# Altium schematic sheet toplayer UCM updated.SchDoc
size A4; SheetNumber: 1; SheetTotal: 5
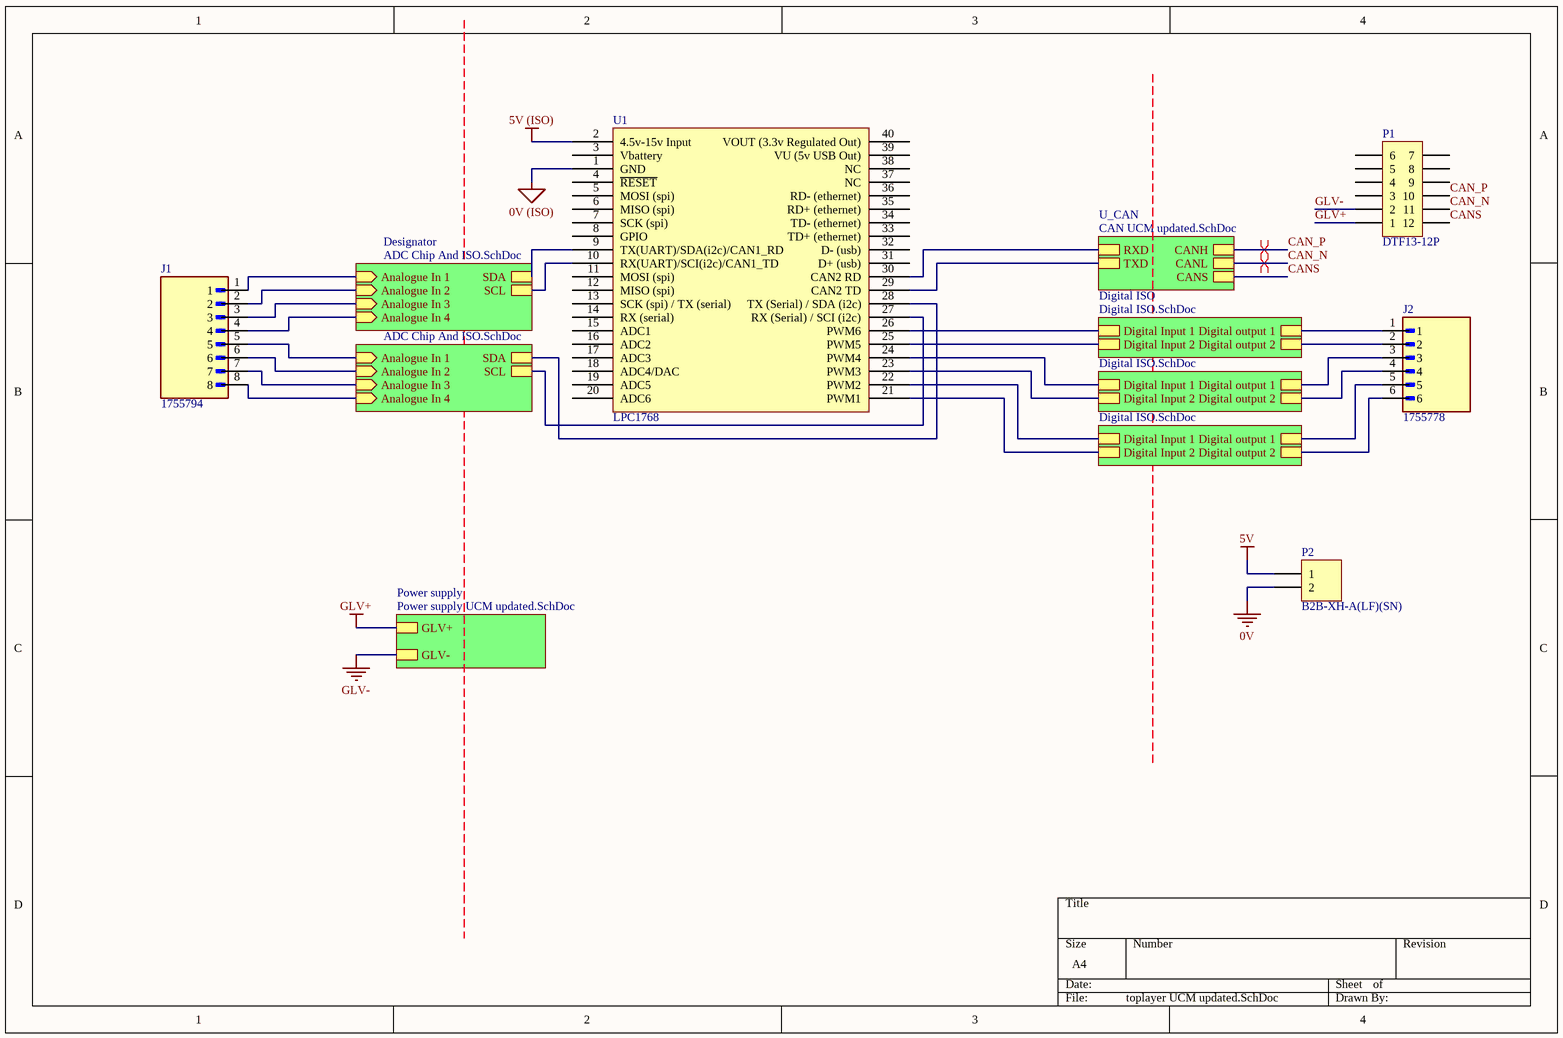
[diagram p0: toplayer UCM updated.SchDoc]

## Parts
J1  1755794  [PHOENIX_1755794]
J2  1755778  [PHOENIX_1755778]
P1  DTF13-12P  [DTF13-12P]
P2  B2B-XH-A(LF)(SN)  [XH 2 PIN VERT]
U1  LPC1768  [LPC1768]

## Sub-sheets
Designator = Digital ISO.SchDoc: Digital Input 1, Digital Input 2, Digital output 1, Digital output 2
Designator = ADC Chip And ISO.SchDoc: Analogue In 1 (in), Analogue In 2 (in), SDA, SCL, Analogue In 3 (in), Analogue In 4 (in)
Designator = ADC Chip And ISO.SchDoc: Analogue In 1 (in), Analogue In 2 (in), SDA, SCL, Analogue In 3 (in), Analogue In 4 (in)
Digital ISO = Digital ISO.SchDoc: Digital Input 1, Digital Input 2, Digital output 1, Digital output 2
Digital ISO = Digital ISO.SchDoc: Digital Input 1, Digital Input 2, Digital output 1, Digital output 2
Power supply = Power supply UCM updated.SchDoc: GLV+, GLV-
U_CAN = CAN UCM updated.SchDoc: RXD, TXD, CANH, CANL, CANS

## Nets
0V: P2.2
0V (ISO): U1.1(GND)
5V: P2.1
5V (ISO): U1.2(4.5v-15v_Input)
GLV+: P1.1 ; sheet Power supply/GLV+
GLV-: P1.2 ; sheet Power supply/GLV-
CAN_N: P1.11 ; sheet U_CAN/CANL
CAN_P: P1.10 ; sheet U_CAN/CANH
CANS: P1.12 ; sheet U_CAN/CANS
NetJ1_1: J1.1 ; sheet Designator/Analogue In 1
NetJ1_2: J1.2 ; sheet Designator/Analogue In 2
NetJ1_3: J1.3 ; sheet Designator/Analogue In 3
NetJ1_4: J1.4 ; sheet Designator/Analogue In 4
NetJ1_5: J1.5 ; sheet Designator/Analogue In 1
NetJ1_6: J1.6 ; sheet Designator/Analogue In 2
NetJ1_7: J1.7 ; sheet Designator/Analogue In 3
NetJ1_8: J1.8 ; sheet Designator/Analogue In 4
NetJ2_1: J2.1 ; sheet Digital ISO/Digital output 1
NetJ2_2: J2.2 ; sheet Digital ISO/Digital output 2
NetJ2_3: J2.3 ; sheet Digital ISO/Digital output 1
NetJ2_4: J2.4 ; sheet Digital ISO/Digital output 2
NetJ2_5: J2.5 ; sheet Designator/Digital output 1
NetJ2_6: J2.6 ; sheet Designator/Digital output 2
NetU1_9: U1.9(TX(UART)/SDA(i2c)/CAN1_RD) ; sheet Designator/SDA
NetU1_10: U1.10(RX(UART)/SCI(i2c)/CAN1_TD) ; sheet Designator/SCL
NetU1_21: U1.21(PWM1) ; sheet Designator/Digital Input 2
NetU1_22: U1.22(PWM2) ; sheet Designator/Digital Input 1
NetU1_23: U1.23(PWM3) ; sheet Digital ISO/Digital Input 2
NetU1_24: U1.24(PWM4) ; sheet Digital ISO/Digital Input 1
NetU1_25: U1.25(PWM5) ; sheet Digital ISO/Digital Input 2
NetU1_26: U1.26(PWM6) ; sheet Digital ISO/Digital Input 1
NetU1_27: U1.27(RX_(Serial)_/_SCI_(i2c)) ; sheet Designator/SCL
NetU1_28: U1.28(TX_(Serial)_/_SDA_(i2c)) ; sheet Designator/SDA
NetU1_29: U1.29(CAN2_TD) ; sheet U_CAN/TXD
NetU1_30: U1.30(CAN2_RD) ; sheet U_CAN/RXD

Not connected (* = marked no-connect by the designer): P1 3 4 5 6 7 8 9; U1 3(Vbattery) 4(~{RESET}) 5(MOSI_(spi)) 6(MISO_(spi)) 7(SCK_(spi)) 8(GPIO) 11(MOSI_(spi)) 12(MISO_(spi)) 13(SCK_(spi)_/_TX_(serial)) 14(RX_(serial)) 15(ADC1) 16(ADC2) 17(ADC3) 18(ADC4/DAC) 19(ADC5) 20(ADC6) 31(D+_(usb)) 32(D-_(usb)) 33(TD+_(ethernet)) 34(TD-_(ethernet)) 35(RD+_(ethernet)) 36(RD-_(ethernet)) 37(NC) 38(NC) 39(VU_(5v_USB_Out)) 40(VOUT_(3.3v_Regulated_Out))

## Layout directives
differential pair: CAN_N, CAN_P

## Library data of the parts
J1 = 1755794: Pluggable Header 5.08mm 12AWG 320V 12A 8 Position COMBICON MSTBVA Series | Phoenix Contact 1755794; SnapEDA_Link: https://www.snapeda.com/parts/1755794/Phoenix+Contact/view-part/?ref=snap; Package: None; Value: *; MF: Phoenix Contact; MP: 1755794; Check_prices: https://www.snapeda.com/parts/1755794/Phoenix+Contact/view-part/?ref=eda
J2 = 1755778: Pluggable Header 5.08mm 12AWG 320V 12A 6 Position COMBICON MSTBVA Series | Phoenix Contact 1755778; SnapEDA_Link: https://www.snapeda.com/parts/1755778/Phoenix+Contact/view-part/?ref=snap; Package: None; Value: *; MF: Phoenix Contact; MP: 1755778; Check_prices: https://www.snapeda.com/parts/1755778/Phoenix+Contact/view-part/?ref=eda
P1 = DTF13-12P: Positions: 12; Pitch: 4.45mm; Angle: 90; Flange: No; Contact: Copper Alloy; Part Number: DTF13-12P; Row Spacing: 4.45mm; Digikey Part Number: 1734-1861-ND; Digikey Link: https://www.digikey.com/products/en?keywords=dtf13-12pa
P2 = B2B-XH-A(LF)(SN): Positions: 2; Pitch: 2.54mm; Angle: 0; Flange: No; Contact: Tin; Part Number: B2B-XH-A(LF)(SN); Row Spacing: 2.54mm; Digikey Part Number: 455-2247-ND; Digikey Link: https://www.digikey.com.au/en/products/detail/jst-sales-america-inc/B2B-XH-A-LF-SN/1651045
U1 = LPC1768: Mbed Development Board LPC1768; Complex IC: 1; Part Number: LPC1768; Manufacturer: MBED